# Altium schematic sheet Sheet1.SchDoc: Sheet-Sensors-Comm
size A4; Author: HALLO Matthieu; CompanyName: YNOV
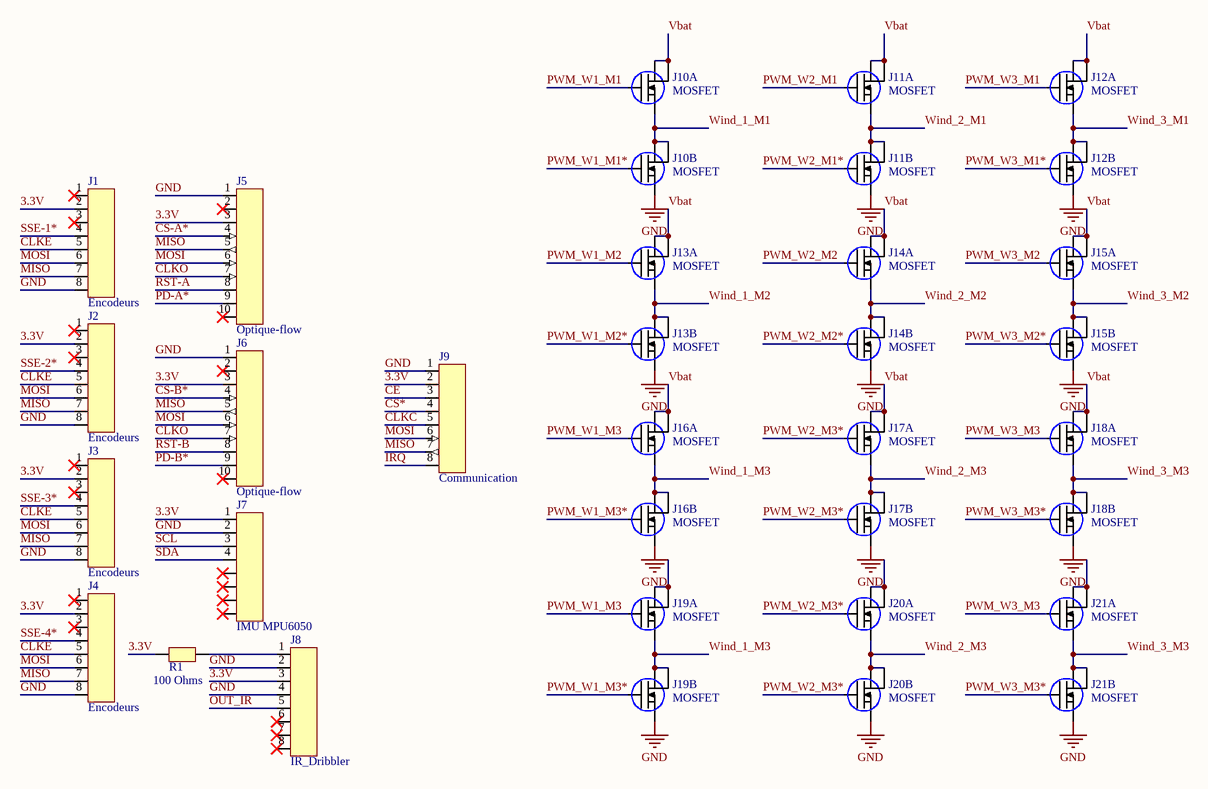
[diagram p0: Sheet1.SchDoc]

## Parts
J1  Encodeurs  [Encodeur/IMU]
J2  Encodeurs  [Encodeur/IMU]
J3  Encodeurs  [Encodeur/IMU]
J4  Encodeurs  [Encodeur/IMU]
J5  Optique-flow  [IR_optique]
J6  Optique-flow  [IR_optique]
J7  IMU MPU6050  [Encodeur/IMU]
J8  IR_Dribbler  [Encodeur/IMU]
J9  Communication  [Comm nRF24L01]
J10  MOSFET  [MOSFET]  (parts A,B of 2)
J11  MOSFET  [MOSFET]  (parts A,B of 2)
J12  MOSFET  [MOSFET]  (parts A,B of 2)
J13  MOSFET  [MOSFET]  (parts A,B of 2)
J14  MOSFET  [MOSFET]  (parts A,B of 2)
J15  MOSFET  [MOSFET]  (parts A,B of 2)
J16  MOSFET  [MOSFET]  (parts A,B of 2)
J17  MOSFET  [MOSFET]  (parts A,B of 2)
J18  MOSFET  [MOSFET]  (parts A,B of 2)
J19  MOSFET  [MOSFET]  (parts A,B of 2)
J20  MOSFET  [MOSFET]  (parts A,B of 2)
J21  MOSFET  [MOSFET]  (parts A,B of 2)
R1  Resistance  [empreinte 1206]  (value not drawn)

## Nets
GND: J1.8 J2.8 J3.8 J4.8 J5.1 J6.1 J7.2 J8.2 J8.4 J9.1 J10.3 J11.3 J12.3 J13.3 J14.3 J15.3 J16.3 J17.3 J18.3 J19.3 J20.3 J21.3
3.3V: J1.2 J2.2 J3.2 J4.2 J5.3 J6.3 J7.1 J8.3 J9.2 R1.1
CE: J9.3
CLKC: J9.5
CLKE: J1.5 J2.5 J3.5 J4.5
CLKO: J5.7 J6.7
CS*: J9.4
CS-A*: J5.4
CS-B*: J6.4
IRQ: J9.8
MISO: J1.7 J2.7 J3.7 J4.7 J5.5 J6.5 J9.7
MOSI: J1.6 J2.6 J3.6 J4.6 J5.6 J6.6 J9.6
OUT_IR: J8.5
PD-A*: J5.9
PD-B*: J6.9
PWM_W1_M1: J10.2
PWM_W1_M1*: J10.4
PWM_W1_M2: J13.2
PWM_W1_M2*: J13.4
PWM_W1_M3: J16.2 J19.2
PWM_W1_M3*: J16.4 J19.4
PWM_W2_M1: J11.2
PWM_W2_M1*: J11.4
PWM_W2_M2: J14.2
PWM_W2_M2*: J14.4
PWM_W2_M3*: J17.2 J17.4 J20.2 J20.4
PWM_W3_M1: J12.2
PWM_W3_M1*: J12.4
PWM_W3_M2: J15.2
PWM_W3_M2*: J15.4
PWM_W3_M3: J18.2 J21.2
PWM_W3_M3*: J18.4 J21.4
RST-A: J5.8
RST-B: J6.8
SCL: J7.3
SDA: J7.4
SSE-1*: J1.4
SSE-2*: J2.4
SSE-3*: J3.4
SSE-4*: J4.4
Vbat: J10.7 J10.8 J11.7 J11.8 J12.7 J12.8 J13.7 J13.8 J14.7 J14.8 J15.7 J15.8 J16.7 J16.8 J17.7 J17.8 J18.7 J18.8
Wind_1_M1: J10.1 J10.5 J10.6
Wind_1_M2: J13.1 J13.5 J13.6
Wind_1_M3: J16.1 J16.5 J16.6 J19.1 J19.5 J19.6
Wind_2_M1: J11.1 J11.5 J11.6
Wind_2_M2: J14.1 J14.5 J14.6
Wind_2_M3: J17.1 J17.5 J17.6 J20.1 J20.5 J20.6
Wind_3_M1: J12.1 J12.5 J12.6
Wind_3_M2: J15.1 J15.5 J15.6
Wind_3_M3: J18.1 J18.5 J18.6 J21.1 J21.5 J21.6
NetJ8_1: J8.1 R1.2
NetJ19_7: J19.7 J19.8
NetJ20_7: J20.7 J20.8
NetJ21_7: J21.7 J21.8

Not connected (* = marked no-connect by the designer): J1 1* 3*; J2 1* 3*; J3 1* 3*; J4 1* 3*; J5 2* 10*; J6 2* 10*; J7 5* 6* 7* 8*; J8 6* 7* 8*

## Library data of the parts
J1-J4 J8 = Encodeurs: AS5048A
J5 J6 = Optique-flow: ADNS3080
J7 = IMU MPU6050: MPU6050 IMU
J9 = Communication: Communication radio
J10-J21 = MOSFET: MOSFET ESC IRF7910 10 A
R1 = Resistance: 100 Ohms: 100 Ohms